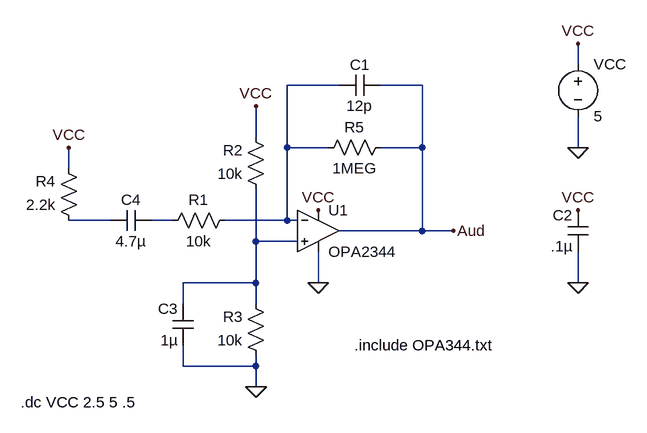
[diagram p0: schematic Draft1.asc]
Draft1.asc, the LTspice schematic file:
Version 4
SHEET 1 880 680
WIRE 624 -144 624 -176
WIRE 256 -112 176 -112
WIRE 384 -112 320 -112
WIRE 128 -32 128 -80
WIRE 176 -16 176 -112
WIRE 240 -16 176 -16
WIRE 384 -16 384 -112
WIRE 384 -16 320 -16
WIRE 624 -16 624 -64
WIRE -160 16 -160 -16
WIRE -96 96 -160 96
WIRE 0 96 -32 96
WIRE 176 96 176 -16
WIRE 176 96 80 96
WIRE 192 96 176 96
WIRE 384 112 384 -16
WIRE 384 112 256 112
WIRE 432 112 384 112
WIRE 128 128 128 48
WIRE 192 128 128 128
WIRE 128 192 128 128
WIRE 128 192 16 192
WIRE 224 192 224 144
WIRE 624 192 624 144
WIRE 16 224 16 192
WIRE 128 224 128 192
WIRE 16 320 16 288
WIRE 128 320 128 304
WIRE 128 320 16 320
WIRE 128 352 128 320
FLAG 624 192 0
FLAG 224 192 0
FLAG 128 352 0
FLAG 624 -16 0
FLAG 624 -176 VCC
FLAG 624 80 VCC
FLAG 224 80 VCC
FLAG -160 -16 VCC
FLAG 128 -80 VCC
FLAG 432 112 Aud
SYMBOL Opamps\\opamp2 224 48 R0
SYMATTR InstName U1
SYMATTR Value OPA2344
SYMBOL res 96 80 R90
WINDOW 0 0 56 VBottom 2
WINDOW 3 32 56 VTop 2
SYMATTR InstName R1
SYMATTR Value 10k
SYMBOL res 144 64 R180
WINDOW 0 36 76 Left 2
WINDOW 3 36 40 Left 2
SYMATTR InstName R2
SYMATTR Value 10k
SYMBOL res 144 320 R180
WINDOW 0 36 76 Left 2
WINDOW 3 36 40 Left 2
SYMATTR InstName R3
SYMATTR Value 10k
SYMBOL res -144 112 R180
WINDOW 0 36 76 Left 2
WINDOW 3 36 40 Left 2
SYMATTR InstName R4
SYMATTR Value 2.2k
SYMBOL res 224 0 R270
WINDOW 0 32 56 VTop 2
WINDOW 3 0 56 VBottom 2
SYMATTR InstName R5
SYMATTR Value 1MEG
SYMBOL cap 320 -128 R90
WINDOW 0 0 32 VBottom 2
WINDOW 3 32 32 VTop 2
SYMATTR InstName C1
SYMATTR Value 12p
SYMBOL cap 640 144 R180
WINDOW 0 24 56 Left 2
WINDOW 3 24 8 Left 2
SYMATTR InstName C2
SYMATTR Value .1µ
SYMBOL cap 32 288 R180
WINDOW 0 24 56 Left 2
WINDOW 3 24 8 Left 2
SYMATTR InstName C3
SYMATTR Value 1µ
SYMBOL cap -96 112 R270
WINDOW 0 32 32 VTop 2
WINDOW 3 0 32 VBottom 2
SYMATTR InstName C4
SYMATTR Value 4.7µ
SYMBOL voltage 624 -160 R0
WINDOW 123 0 0 Left 2
WINDOW 39 0 0 Left 2
SYMATTR InstName VCC
SYMATTR Value 5
TEXT 280 288 Left 2 !.include OPA344.txt
TEXT -234 376 Left 2 !.dc VCC 2.5 5 .5

The netlist it stands for:
* Draft1.asc
XU1 N004 N001 VCC 0 Aud OPA2344  ; pins In+ In- V+ V- OUT
R1 N001 N003 10k
R2 N004 VCC 10k
R3 0 N004 10k
R4 N002 VCC 2.2k
R5 N001 Aud 1MEG
C1 Aud N001 12p
C2 0 VCC .1µ
C3 0 N004 1µ
C4 N002 N003 4.7µ
VCC VCC 0 5
.include OPA344.txt
.dc VCC 2.5 5 .5
.backanno
.end